# EAGLE design tec_controller (EAGLE 6.5.0)
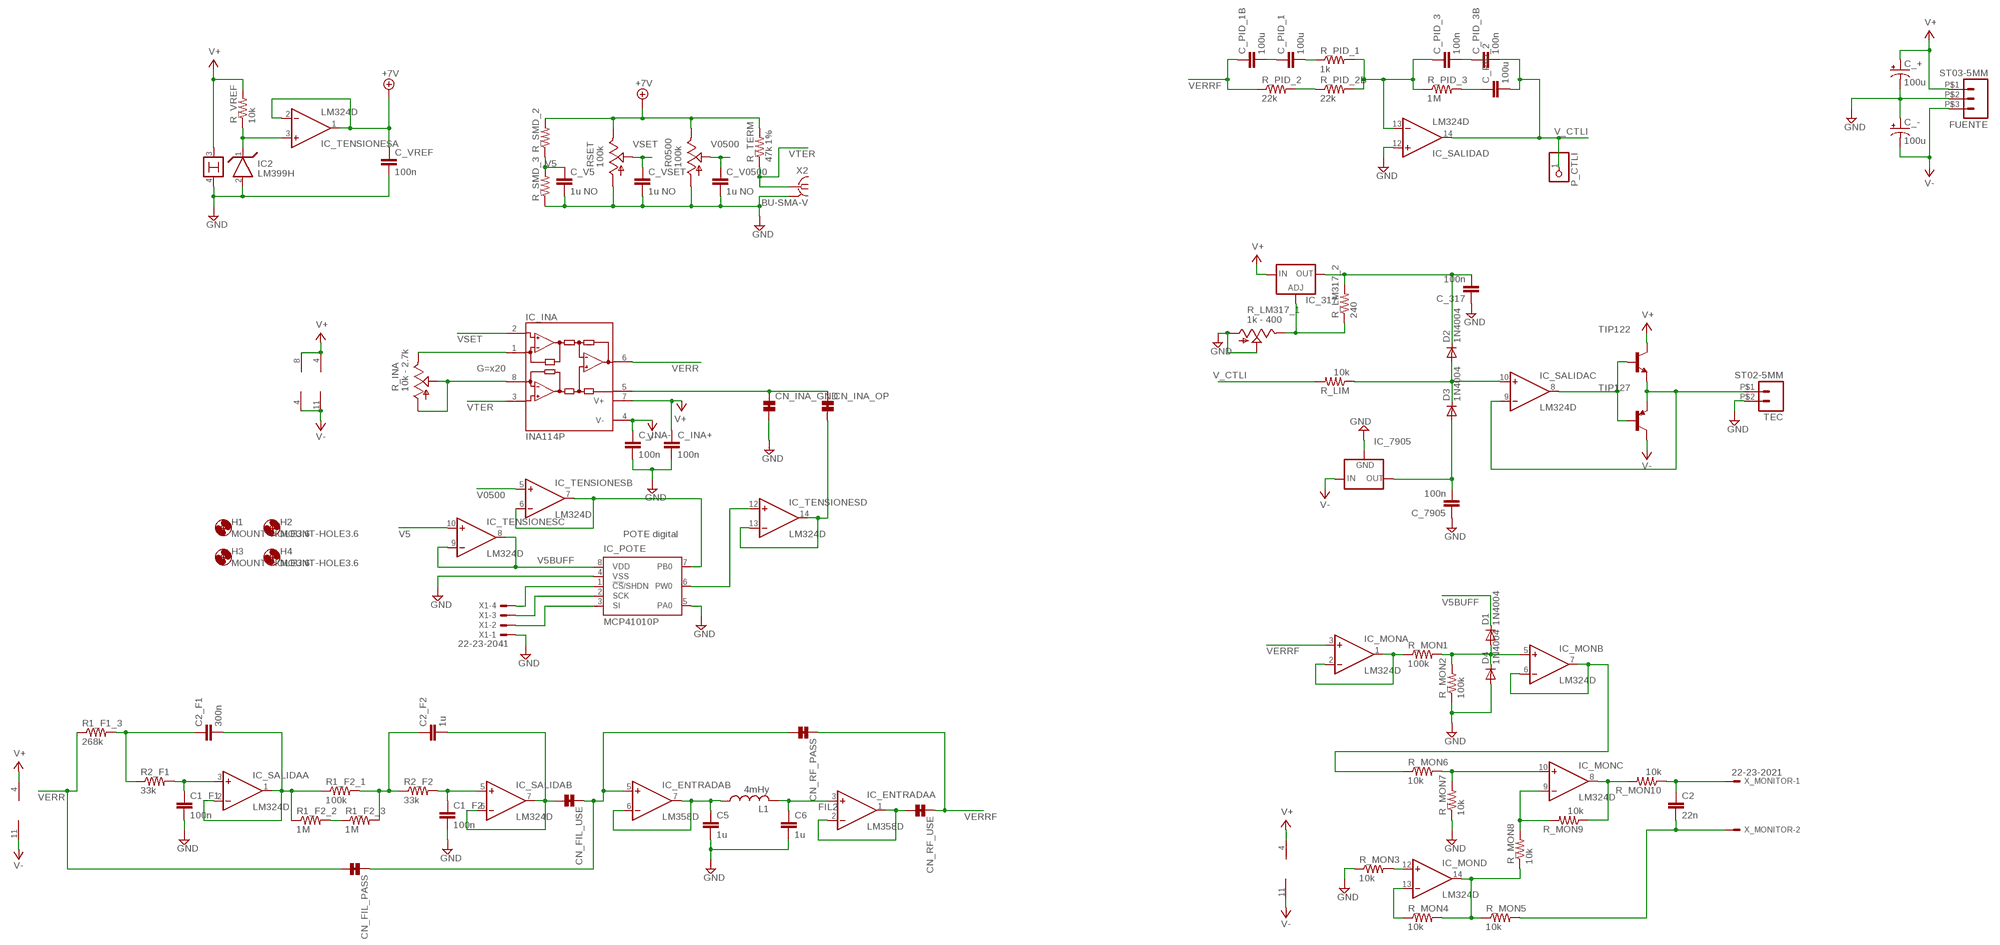
[diagram p0: schematic, sheet 1]

## Parts
C1_F1  100n  C-EUC0603  [C0603]
C1_F2  100n  C-EUC0603  [C0603]
C2  22n  C-EUC1206  [C1206]
C2_F1  300n  C-EUC0603  [C0603]
C2_F2  1u  C-EUC0805  [C0805]
C5  1u  C-EUC0805  [C0805]
C6  1u  C-EUC0805  [C0805]
C_317  100n  C-EUC0603  [C0603]
C_7905  100n  C-EUC0603  [C0603]
C_+  100u  CPOL-USE3.5-10  [E3,5-10]
C_-  100u  CPOL-USE3.5-10  [E3,5-10]
C_INA+  100n  C-EUC0603  [C0603]
C_INA-  100n  C-EUC0603  [C0603]
C_PID_1  100u  C-EU050-050X075  [C050-050X075]
C_PID_1B  100u  C-EU050-050X075  [C050-050X075]
C_PID_2  100u  C-EU050-050X075  [C050-050X075]
C_PID_3  100n  C-EUC0603  [C0603]
C_PID_3B  100n  C-EUC0603  [C0603]
C_V5  1u NO  C-EUC0805  [C0805]
C_V0500  1u NO  C-EUC0805  [C0805]
C_VREF  100n  C-EUC0603  [C0603]
C_VSET  1u NO  C-EUC0805  [C0805]
CN_FIL_PASS  LINK  [LINK_PAC_0603]
CN_FIL_USE  LINK  [LINK_PAC_0603]
CN_INA_GND  LINK  [LINK_PAC_0603]
CN_INA_OP  LINK  [LINK_PAC_0603]
CN_RF_PASS  LINK  [LINK_PAC_0603]
CN_RF_USE  LINK  [LINK_PAC_0603]
D1  1N4004  [DO41-10]
D2  1N4004  [DO41-10]
D3  1N4004  [DO41-10]
D4  1N4004  [DO41-10]
FUENTE  ST03-5MM  [EK500V-03P]
H1  MOUNT-HOLE3.6  [3,6]
H2  MOUNT-HOLE3.6  [3,6]
H3  MOUNT-HOLE3.6  [3,6]
H4  MOUNT-HOLE3.6  [3,6]
IC2  LM399H  [TO39/4]
IC_317  LM317TS  [317TS]
IC_7905  79XXS  [79XXS]
IC_ENTRADA  LM358D  [SO08]
IC_INA  INA114P  [DIL08]
IC_MON  LM324D  [SO14]
IC_POTE  MCP41010P  [DIL8]
IC_SALIDA  LM324D  [SO14]
IC_TENSIONES  LM324D  [SO14]
L1  4mHy  L-US0207/15  [0207/15]
P_CTLI  PINHD-1X1  [1X01]
R1_F1_3  268k  R-US_0207/15  [0207/15]
R1_F2_1  100k  R-US_M1206  [M1206]
R1_F2_2  1M  R-US_M1206  [M1206]
R1_F2_3  1M  R-US_M1206  [M1206]
R2_F1  33k  R-US_M1206  [M1206]
R2_F2  33k  R-US_M1206  [M1206]
R0500  100k  TRIM_US-B64Y  [B64Y]
R_INA  10k - 2.7k  TRIM_US-B64Y  [B64Y]
R_LIM  10k  R-US_M1206  [M1206]
R_LM317_1  1k - 400  TRIM_US-B64Y  [B64Y]
R_LM317_2  240  R-US_0207/10  [0207/10]
R_MON1  100k  R-US_M1206  [M1206]
R_MON2  100k  R-US_M1206  [M1206]
R_MON3  10k  R-US_M1206  [M1206]
R_MON4  10k  R-US_M1206  [M1206]
R_MON5  10k  R-US_M1206  [M1206]
R_MON6  10k  R-US_M1206  [M1206]
R_MON7  10k  R-US_M1206  [M1206]
R_MON8  10k  R-US_M1206  [M1206]
R_MON9  10k  R-US_M1206  [M1206]
R_MON10  10k  R-US_M1206  [M1206]
R_PID_1  1k  R-US_M1206  [M1206]
R_PID_2  22k  R-US_M1206  [M1206]
R_PID_2B  22k  R-US_M1206  [M1206]
R_PID_3  1M  R-US_M1206  [M1206]
R_SMD_2  R-US_M1206  [M1206]
R_SMD_3  R-US_M1206  [M1206]
R_TERM  47k 1%  R-US_0207/10  [0207/10]
R_VREF  10k  R-US_M1206  [M1206]
RSET  100k  TRIM_US-B64Y  [B64Y]
TEC  ST02-5MM  [EK500V-02P]
TIP122  -NPN-TO126V  [TO126V]
TIP127  -PNP-TO126V  [TO126V]
X1  22-23-2041  [22-23-2041]
X2  BU-SMA-V  [BU-SMA-V]
X_MONITOR  22-23-2021  [22-23-2021]

## Nets
+7V: C_VREF.1 IC_TENSIONES.1(A:OUT) IC_TENSIONES.2(A:-IN) R0500.E R_SMD_2.2 R_TERM.2 RSET.E
FIL2: C6.1 IC_ENTRADA.3(A:+IN) L1.2
GND: C1_F1.2 C1_F2.2 C5.2 C6.2 C_317.1 C_7905.1 C_+.- C_-.+ C_INA+.2 C_INA-.2 C_V5.2 C_V0500.2 C_VREF.2 C_VSET.2 CN_INA_GND.2 D4.A FUENTE.P$2 IC2.2 IC2.4 IC_7905.GND IC_POTE.4(VSS) IC_POTE.5(PA0) IC_SALIDA.12(D:+IN) R0500.A R_LM317_1.A R_LM317_1.S R_MON2.1 R_MON3.1 R_MON7.1 R_SMD_3.1 RSET.A TEC.P$2 X1.1 X2.2 X2.3 X2.4 X2.5
N$1: IC2.1 IC_TENSIONES.3(A:+IN) R_VREF.1
N$2: IC_INA.1(RG) R_INA.E
N$3: IC_INA.8(RG) R_INA.A R_INA.S
N$4: C_PID_1.2 R_PID_1.1
N$5: IC_MON.1(A:OUT) IC_MON.2(A:-IN) R_MON1.1
N$6: IC_MON.12(D:+IN) R_MON3.2
N$7: C5.1 IC_ENTRADA.6(B:-IN) IC_ENTRADA.7(B:OUT) L1.1
N$8: CN_RF_USE.2 IC_ENTRADA.1(A:OUT) IC_ENTRADA.2(A:-IN)
N$9: C2_F1.1 R1_F1_3.2 R2_F1.1
N$10: C1_F1.1 IC_SALIDA.3(A:+IN) R2_F1.2
N$11: C2_F1.2 IC_SALIDA.1(A:OUT) IC_SALIDA.2(A:-IN) R1_F2_1.1 R1_F2_2.1
N$12: R1_F2_2.2 R1_F2_3.1
N$13: C2_F2.1 R1_F2_1.2 R1_F2_3.2 R2_F2.1
N$14: IC_POTE.7(PB0) IC_TENSIONES.6(B:-IN) IC_TENSIONES.7(B:OUT)
N$15: C1_F2.1 IC_SALIDA.5(B:+IN) R2_F2.2
N$16: IC_POTE.6(PW0) IC_TENSIONES.12(D:+IN)
N$17: CN_INA_GND.1 CN_INA_OP.1 IC_INA.5(REF)
N$18: IC_POTE.1(!CS!/SHDN) X1.4
N$19: CN_INA_OP.2 IC_TENSIONES.13(D:-IN) IC_TENSIONES.14(D:OUT)
N$20: IC_POTE.2(SCK) X1.3
N$21: IC_POTE.3(SI) X1.2
N$22: R_PID_2.2 R_PID_2B.1
N$23: C_PID_1.1 C_PID_1B.2
N$24: C_PID_3.1 IC_SALIDA.13(D:-IN) R_PID_1.2 R_PID_2B.2 R_PID_3.1
N$25: IC_317.1(ADJ) R_LM317_1.E R_LM317_2.1
N$26: C_PID_2.1 R_PID_3.2
N$27: D2.A D3.C IC_SALIDA.10(C:+IN) R_LIM.1
N$28: C_PID_3.2 C_PID_3B.1
N$29: IC_SALIDA.8(C:OUT) TIP122.3(B) TIP127.3(B)
N$30: D1.A D4.C IC_MON.5(B:+IN) R_MON1.2 R_MON2.2
N$31: IC_MON.6(B:-IN) IC_MON.7(B:OUT) R_MON6.1
N$34: IC_MON.10(C:+IN) R_MON6.2 R_MON7.2
N$35: IC_MON.9(C:-IN) R_MON8.2 R_MON9.2
N$36: IC_MON.14(D:OUT) R_MON4.2 R_MON5.1 R_MON8.1
N$37: IC_MON.13(D:-IN) R_MON4.1
N$38: C2.2 R_MON5.2 X_MONITOR.2
N$39: IC_MON.8(C:OUT) R_MON9.1 R_MON10.2
N$40: C2.1 R_MON10.1 X_MONITOR.1
V5: C_V5.1 IC_TENSIONES.10(C:+IN) R_SMD_2.1 R_SMD_3.2
V5BUFF: D1.C IC_POTE.8(VDD) IC_TENSIONES.8(C:OUT) IC_TENSIONES.9(C:-IN)
V0500: C_V0500.1 IC_TENSIONES.5(B:+IN) R0500.S
V+: C_+.+ C_INA+.1 FUENTE.P$1 IC2.3 IC_317.3(IN) IC_ENTRADA.8(P:V+) IC_INA.7(V+) IC_MON.4(P:V+) IC_SALIDA.4(P:V+) IC_TENSIONES.4(P:V+) R_VREF.2 TIP122.2(C)
V-: C_-.- C_INA-.1 FUENTE.P$3 IC_7905.IN IC_ENTRADA.4(P:V-) IC_INA.4(V-) IC_MON.11(P:V-) IC_SALIDA.11(P:V-) IC_TENSIONES.11(P:V-) TIP127.2(C)
V_317: C_317.2 D2.C IC_317.2(OUT) R_LM317_2.2
V_7905: C_7905.2 D3.A IC_7905.OUT
V_CTLI: C_PID_2.2 C_PID_3B.2 IC_SALIDA.14(D:OUT) P_CTLI.1 R_LIM.2
VERR: CN_FIL_PASS.2 IC_INA.6(OUT) R1_F1_3.1
VERRF: C_PID_1B.1 CN_RF_PASS.1 CN_RF_USE.1 IC_MON.3(A:+IN) R_PID_2.1
VERRF_B: CN_FIL_PASS.1 CN_FIL_USE.1 CN_RF_PASS.2 IC_ENTRADA.5(B:+IN)
VERRF_SALIDA: C2_F2.2 CN_FIL_USE.2 IC_SALIDA.6(B:-IN) IC_SALIDA.7(B:OUT)
VSET: C_VSET.1 IC_INA.2(-IN) RSET.S
VTEC: IC_SALIDA.9(C:-IN) TEC.P$1 TIP122.1(E) TIP127.1(E)
VTER: IC_INA.3(+IN) R_TERM.1 X2.1

## Notes on the sheet
- G=x20
- POTE digital

## Library data of the parts
C1_F1 C1_F2 C2 C2_F1 C2_F2 C5 C6 C_317 C_7905 C_INA+ C_INA- C_PID_1 C_PID_1B C_PID_2 C_PID_3 C_PID_3B C_V5 C_V0500 C_VREF C_VSET = rcl:C-EU: CAPACITOR, European symbol
C_+ C_- = rcl:CPOL-US: POLARIZED CAPACITOR, American symbol
CN_FIL_PASS CN_FIL_USE CN_INA_GND CN_INA_OP CN_RF_PASS CN_RF_USE = 00_Lolo:LINK
D1-D4 = diode:1N4004: DIODE general purpose rectifier, 1 A
FUENTE = con-dinkle:ST03: Dinkle® Screw Terminal Block - 3 Way -5MM: EK500V series. Rated at 20A, 300VAC. Cable size: 2mm² Supplier: Altronics P2035A Source: http://www.dinkle.com/upfiles/proter21253708953.pdf -3.5MM: ED350V series. Rated at 10A, 300VAC. Cable size: 1.4mm² Supplier: Altronics P2029 Source: http://www.dinkle.com/upfiles/proter21253714491.pdf
H1-H4 = holes:MOUNT-HOLE: MOUNTING HOLE with drill center marker
IC2 = linear:LM399H: Precision Z DIODE
IC_317 = v-reg:LM317TS: VOLTAGE REGULATOR
IC_7905 = v-reg:79XXS: VOLTAGE REGULATOR
IC_ENTRADA = linear:LM358: OP AMP also LM158; LM258; LM2904 Source: http://cache.national.com/ds/LM/LM158.pdf
IC_INA = burr-brown:INA114: Precision Instrumentation Amplifier; MF: TEXAS INSTRUMENTS; MPN: INA114BP; OC_FARNELL: 1212399; OC_NEWARK: 74K3810
IC_MON IC_SALIDA IC_TENSIONES = linear:LM324: OP AMP
IC_POTE = 00_Lolo:MCP41010: Single/Dual Digital Potentiometer with SPI TM Interface Source: http://che126.che.caltech.edu/11195c.pdf; MF: MICROCHIP
L1 = rcl:L-US: INDUCTOR, American symbol
P_CTLI = pinhead:PINHD-1X1: PIN HEADER
R1_F1_3 R1_F2_1-R1_F2_3 R2_F1 R2_F2 R_LIM R_LM317_2 R_MON1-R_MON10 R_PID_1 R_PID_2 R_PID_2B R_PID_3 R_SMD_2 R_SMD_3 R_TERM R_VREF = rcl:R-US_: RESISTOR, American symbol
R0500 R_INA R_LM317_1 RSET = pot:TRIM_US-: POTENTIOMETER
TEC = con-dinkle:ST02: Dinkle® Screw Terminal Block - 2 Way -5MM: EK500V series. Rated at 20A, 300VAC. Cable size: 2mm² Supplier: Altronics P2034A Source: http://www.dinkle.com/upfiles/proter21253708953.pdf -5.08MM: The back half of a EK500V4R-04P. Rated at 20A, 300VAC. Cable size: 2mm² Supplier: Altronics P2024 (half of) Source: http://www.dinkle.com/upfiles/proter21253708833.pdf -3.5MM: ED350V series. Rated at 10A, 300VAC. Cable size: 1.4mm² Supplier: Altronics P2028 Source: http://www.dinkle.com/upfiles/proter21253714491.pdf
TIP122 = transistor:*-NPN-: NPN Transistror BF959 corrected 2008.03.06
TIP127 = transistor:*-PNP-: PNP Transistror
X1 = con-molex:22-23-2041: .100" (2.54mm) Center Header - 4 Pin; MF: MOLEX; MPN: 22-23-2041; OC_FARNELL: 1462920; OC_NEWARK: 38C0355
X2 = con-coax:BU-SMA-V: FEMALE SMA CONNECTOR Radiall distributor RS 112-3794; OC_FARNELL: unknown; OC_NEWARK: unknown
X_MONITOR = con-molex:22-23-2021: .100" (2.54mm) Center Header - 2 Pin; MF: MOLEX; MPN: 22-23-2021; OC_FARNELL: 1462926; OC_NEWARK: 25C3832

## Board
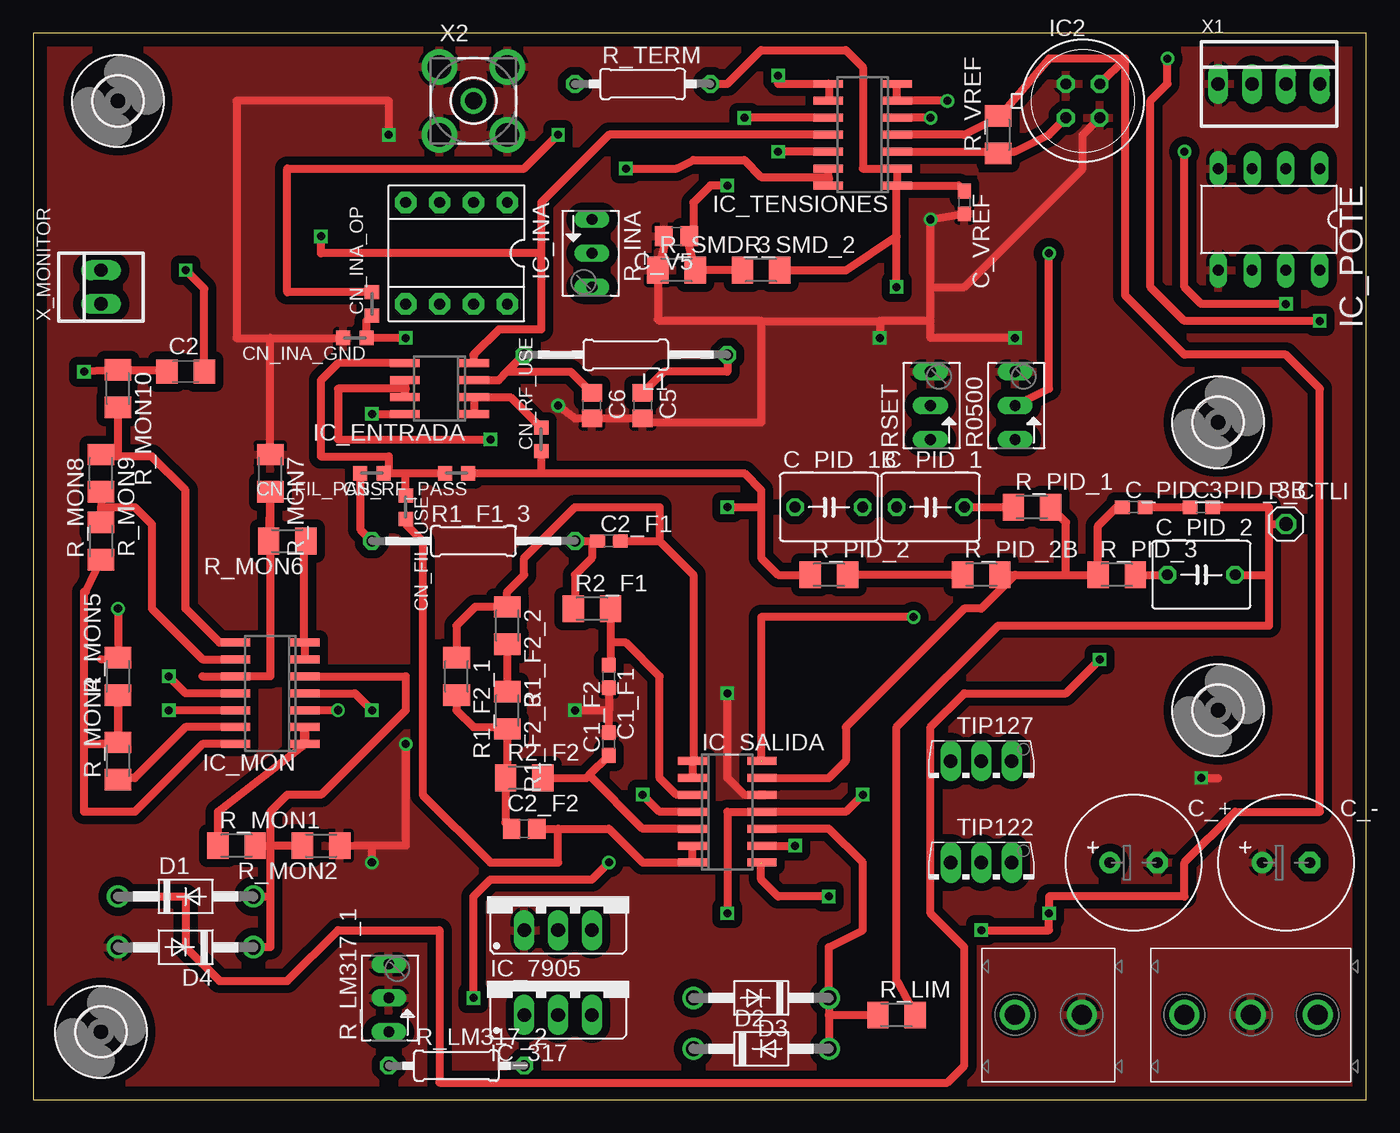
[diagram p1: board, top side]
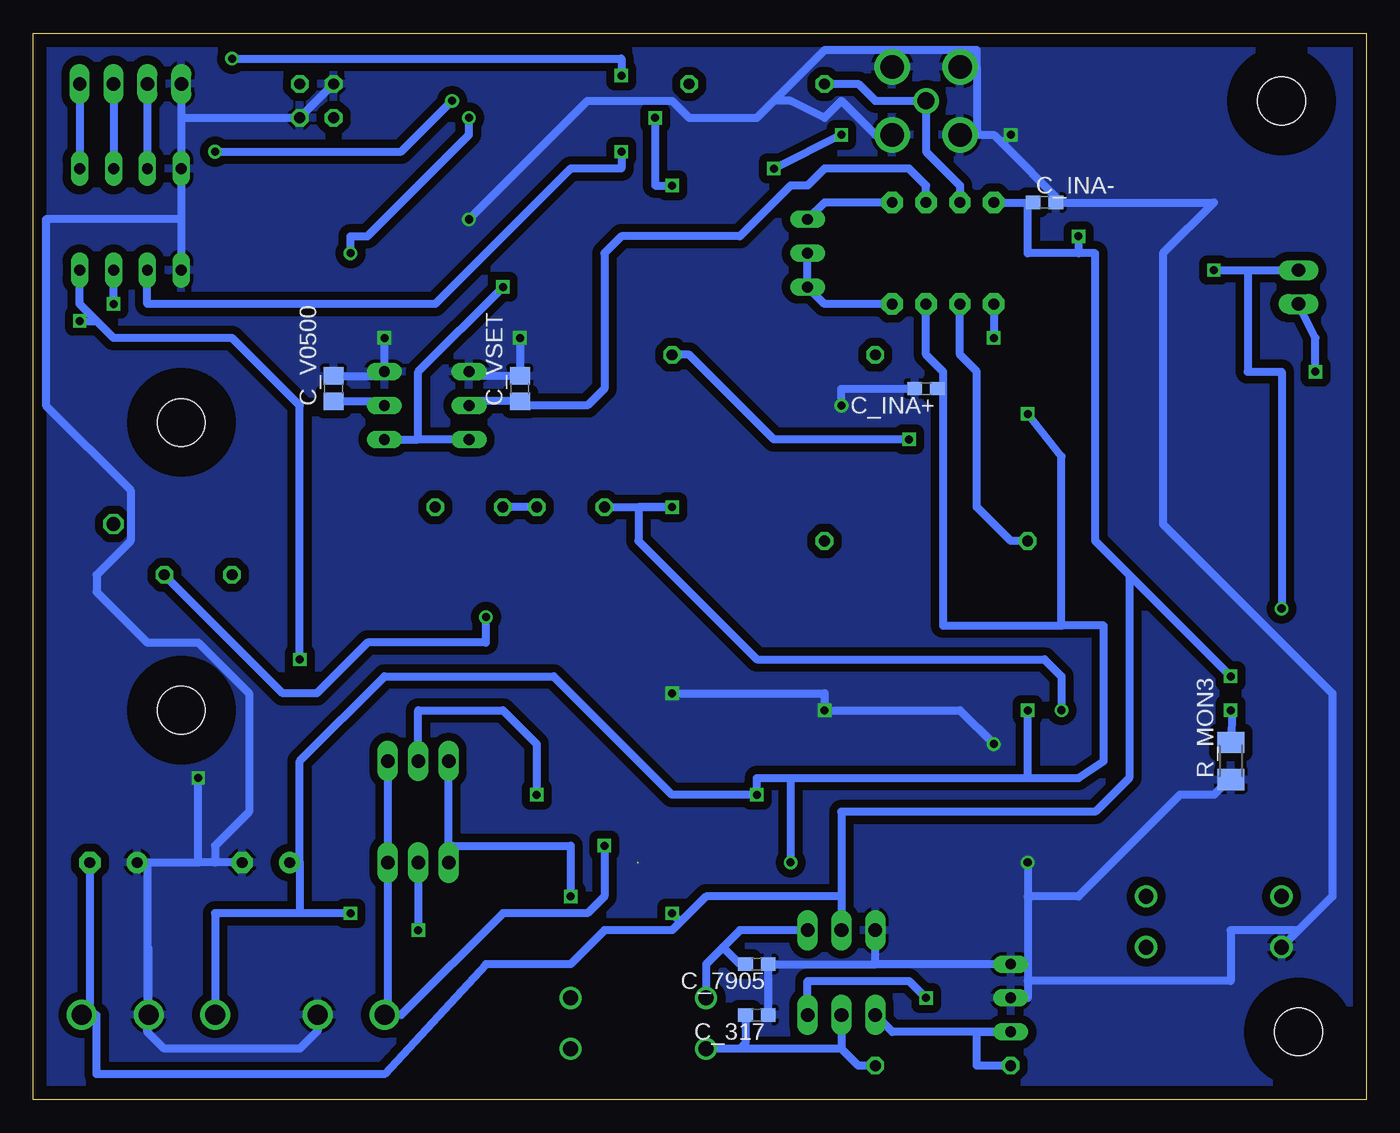
[diagram p2: board, bottom side, seen from below]

Size 100 x 80 mm. Coordinates in mm from the lower left corner, seen from the top.
Outline: 0,0 100,0 100,80 0,80 0,0
Copper layers (1*16): Top 0.035mm / dielectric 1.5mm / Bottom 0.035mm
Design rules "default *": minimum track width 24mil, minimum drill 24mil, track to track 24mil, track to pad 16mil, pad to pad 16mil, via to via 16mil, smd to smd 8mil, copper to edge 40mil, drill to drill 8mil, minimum pad ring 10mil, minimum via ring 8mil, stop-mask expansion 4mil, vias tented up to drill 0mil, thermal gap 10mil

### Footprints (pad centres in the part's own frame; a part is rotated, then mirrored left to right if it is on the bottom)
C0603 = smd 1.1 x 1: 1 -0.85,0; 2 0.85,0
C1206 = smd 1.6 x 1.8: 1 -1.4,0; 2 1.4,0
C0805 = smd 1.3 x 1.5: 1 -0.95,0; 2 0.95,0
E3,5-10 = drill 0.813 pad 1.6: + -1.778,0 | drill 0.813 pad 1.6 octagon: - 1.778,0
C050-050X075 = drill 0.813 octagon: 1 -2.54,0; 2 2.54,0
LINK_PAC_0603 = smd 1.05 x 1.08: 1 -0.875,0; 2 0.875,0
DO41-10 = drill 1.118: A 5.08,0; C -5.08,0
EK500V-03P = drill 1.5: P$1 0,0; P$2 5,0; P$3 10,0
3,6 = hole 3.6: 0,0
TO39/4 = drill 0.813 octagon: 1 -1.27,-1.27; 2 1.27,-1.27; 3 1.27,1.27; 4 -1.27,1.27
317TS = drill 1.016 long: 1 -2.54,-2.54; 2 0,-2.54; 3 2.54,-2.54
79XXS = drill 1.016 long: GND -2.54,-2.54; IN 0,-2.54; OUT 2.54,-2.54
SO08 = smd 0.6 x 2.2: 1 -1.905,-2.6; 2 -0.635,-2.6; 3 0.635,-2.6; 4 1.905,-2.6; 5 1.905,2.6; 6 0.635,2.6; 7 -0.635,2.6; 8 -1.905,2.6
DIL08 = drill 0.813 pad 1.6 octagon: 1 -3.81,-3.81; 2 -1.27,-3.81; 3 1.27,-3.81; 4 3.81,-3.81; 5 3.81,3.81; 6 1.27,3.81; 7 -1.27,3.81; 8 -3.81,3.81
SO14 = smd 0.6 x 2.2: 1 -3.81,-2.6; 2 -2.54,-2.6; 3 -1.27,-2.6; 4 0,-2.6; 5 1.27,-2.6; 6 2.54,-2.6; 7 3.81,-2.6; 8 3.81,2.6; 9 2.54,2.6; 10 1.27,2.6; 11 0,2.6; 12 -1.27,2.6; 13 -2.54,2.6; 14 -3.81,2.6
DIL8 = drill 0.813 long: 1 -3.81,-3.81; 2 -1.27,-3.81; 3 1.27,-3.81; 4 3.81,-3.81; 5 3.81,3.81; 6 1.27,3.81; 7 -1.27,3.81; 8 -3.81,3.81
0207/15 = drill 0.813 octagon: 1 -7.62,0; 2 7.62,0
1X01 = drill 1.016 octagon: 1 0,0
M1206 = smd 1.6 x 2: 1 -1.4,0; 2 1.4,0
B64Y = drill 0.813 long: A 2.54,0; E -2.54,0; S 0,0
0207/10 = drill 0.813 octagon: 1 -5.08,0; 2 5.08,0
EK500V-02P = drill 1.5: P$1 0,0; P$2 5,0
TO126V = drill 1.016 long: 1 -2.286,-1.27; 2 0,-1.27; 3 2.286,-1.27
22-23-2041 = drill 1 long: 1 -3.81,0; 2 -1.27,0; 3 1.27,0; 4 3.81,0
BU-SMA-V = drill 1.27: 1 0,0 | drill 1.778: 2 -2.55,2.55; 3 2.55,2.55; 4 2.55,-2.55; 5 -2.55,-2.55
22-23-2021 = drill 1 long: 1 -1.27,0; 2 1.27,0

### Placement (x,y rotation side)
C1_F1  43.18,31.75 270 top
C1_F2  43.18,26.67 90 top
C2  11.43,54.61 0 top
C2_F1  43.18,41.91 0 top
C2_F2  36.83,20.32 0 top
C5  45.72,52.07 270 top
C6  41.91,52.07 270 top
C_317  45.72,6.35 180 bottom
C_7905  45.72,10.16 180 bottom
C_+  82.55,17.78 0 top
C_-  93.98,17.78 0 top
C_INA+  33.02,53.34 180 bottom
C_INA-  24.13,67.31 0 bottom
C_PID_1  67.31,44.45 0 top
C_PID_1B  59.69,44.45 0 top
C_PID_2  87.63,39.37 0 top
C_PID_3  82.55,44.45 0 top
C_PID_3B  87.63,44.45 0 top
C_V5  48.26,64.77 180 top
C_V0500  77.47,53.34 90 bottom
C_VREF  69.85,67.31 270 top
C_VSET  63.5,53.34 90 bottom
CN_FIL_PASS  25.4,46.99 180 top
CN_FIL_USE  27.94,44.45 270 top
CN_INA_GND  24.13,57.15 180 top
CN_INA_OP  25.4,59.69 90 top
CN_RF_PASS  31.75,46.99 180 top
CN_RF_USE  38.1,49.53 90 top
D1  11.43,15.24 0 top
D2  54.61,3.81 0 top
D3  54.61,7.62 180 top
D4  11.43,11.43 180 top
FUENTE  86.36,6.35 0 top
H1  6.35,74.93 0 top
H2  5.08,5.08 0 top
H3  88.9,29.21 0 top
H4  88.9,50.8 0 top
IC2  78.74,74.93 0 top
IC_317  39.37,8.89 0 top
IC_7905  39.37,15.24 0 top
IC_ENTRADA  30.48,53.34 90 top
IC_INA  31.75,63.5 180 top
IC_MON  17.78,30.48 90 top
IC_POTE  92.71,66.04 180 top
IC_SALIDA  52.07,21.59 270 top
IC_TENSIONES  62.23,72.39 90 top
L1  44.45,55.88 180 top
P_CTLI  93.98,43.18 0 top
R1_F1_3  33.02,41.91 0 top
R1_F2_1  31.75,31.75 270 top
R1_F2_2  35.56,35.56 270 top
R1_F2_3  35.56,29.21 270 top
R2_F1  41.91,36.83 0 top
R2_F2  36.83,24.13 0 top
R0500  73.66,52.07 90 top
R_INA  41.91,63.5 270 top
R_LIM  64.77,6.35 0 top
R_LM317_1  26.67,7.62 90 top
R_LM317_2  31.75,2.54 0 top
R_MON1  15.24,19.05 0 top
R_MON2  21.59,19.05 180 top
R_MON3  10.16,25.4 90 bottom
R_MON4  6.35,25.4 90 top
R_MON5  6.35,31.75 90 top
R_MON6  19.05,41.91 180 top
R_MON7  17.78,46.99 270 top
R_MON8  5.08,41.91 90 top
R_MON9  5.08,46.99 270 top
R_MON10  6.35,53.34 270 top
R_PID_1  74.93,44.45 0 top
R_PID_2  59.69,39.37 0 top
R_PID_2B  71.12,39.37 0 top
R_PID_3  81.28,39.37 0 top
R_SMD_2  54.61,62.23 0 top
R_SMD_3  48.26,62.23 0 top
R_TERM  45.72,76.2 0 top
R_VREF  72.39,72.39 90 top
RSET  67.31,52.07 90 top
TEC  73.66,6.35 0 top
TIP122  71.12,16.51 180 top
TIP127  71.12,24.13 180 top
X1  92.71,76.2 0 top
X2  33.02,74.93 0 top
X_MONITOR  5.08,60.96 90 top

### Tracks (layer width: path | path; a pad name or v marks a point on that pad's centre or on a via)
+7V  (via drill 0.6)
  Top 0.61: IC_TENSIONES.1 IC_TENSIONES.2 62.23,69.85 62.23,77.47 60.96,78.74 54.61,78.74 52.07,76.2 R_TERM.2 | IC_TENSIONES.1 69.43,68.58 C_VREF.1 | R_SMD_2.2 60.96,62.23 64.77,64.77 | 64.77,64.77 64.77,68.52 IC_TENSIONES.1 | v64.77,60.96 64.77,64.77
  Bottom 0.61: RSET.E 71.12,49.53 | R0500.E 71.12,49.53 | 71.12,49.53 71.12,54.61 v64.77,60.96
FIL2
  Top 0.61: L1.2 35.56,54.61 | IC_ENTRADA.3 34.92,53.98 35.56,54.61 | 35.56,54.61 40.32,54.61 C6.1
GND  (via drill 0.6, 0.61)
  Top 0.61: C_V5.2 47.31,63.95 R_SMD_3.1 46.86,58.55 46.99,58.42 54.61,58.42 | C1_F1.2 43.18,29.21 | C1_F2.2 43.18,29.21 | 43.18,29.21 v40.64,29.21 | 17.78,57.15 R_MON7.1 17.78,48.26 | 17.78,57.15 15.24,57.15 15.24,74.93 26.67,74.93 v26.67,72.39 | 17.78,57.15 CN_INA_GND.2 | v39.37,52.07 40.64,51.12 C6.2 C5.2 45.72,50.8 54.61,50.8 54.61,58.42 | 67.31,58.42 67.31,60.96 | 67.31,60.96 v67.31,66.04 C_VREF.2 | 25.4,19.05 27.94,19.05 v27.94,26.67 | 67.31,60.96 69.85,60.96 78.74,69.85 78.74,72.39 IC2.2 | v25.4,17.78 25.4,19.05 | 25.4,19.05 24.13,19.05 22.86,18.92 R_MON2.1 | v52.07,30.48 52.07,24.13 53.34,22.86 IC_SALIDA.12 | 54.61,58.42 63.5,58.42 | v73.66,57.15 67.31,57.15 67.31,58.42 | 67.31,58.42 63.5,58.42 | 63.5,58.42 v63.5,57.15 | v87.63,24.13 88.9,24.13
  Bottom 0.61: RSET.A 66.99,54.29 C_VSET.2 v63.5,57.15 | C_V0500.2 73.98,54.29 R0500.A v73.66,57.15 | C_317.1 C_7905.1 36.83,10.16 | 36.83,10.16 IC_7905.GND | 36.83,10.16 R_LM317_1.A 25.4,10.16 | X1.1 88.9,73.66 | 88.9,73.66 IC_POTE.4 88.9,66.04 | 88.9,66.04 IC_POTE.5 | R_MON3.1 10.16,24.13 11.43,22.86 13.97,22.86 21.59,15.24 25.4,15.24 | 27.3,71.75 27.94,72.39 29.21,72.39 | 27.3,71.75 22.86,67.31 | 29.21,72.39 X2.5 | 5.08,12.7 2.54,15.24 2.54,30.48 15.24,43.18 15.24,63.5 11.43,67.31 22.86,67.31 | 22.86,67.31 C_INA-.2 | v39.37,52.07 39.37,53.34 C_INA+.2 | 88.9,66.04 99.06,66.04 99.06,52.07 92.71,45.72 92.71,41.91 95.25,39.37 95.25,38.1 91.44,34.29 87.63,34.29 83.82,30.48 83.82,21.59 86.36,19.05 86.36,17.78 | 92.71,17.78 C_-.+ | v25.4,17.78 25.4,15.24 | 25.4,15.24 25.4,10.16 | 25.4,10.16 25.4,8.89 | 25.4,8.89 25.4,7.62 R_LM317_1.S | v27.94,26.67 30.48,29.21 v40.64,29.21 40.64,30.48 v52.07,30.48 | 88.9,73.66 IC2.2 IC2.4 | v67.31,66.04 58.42,74.93 52.07,74.93 50.8,73.66 45.72,73.66 44.45,74.93 | C_-.+ 91.44,17.78 91.44,11.43 | 91.44,11.43 91.44,6.43 FUENTE.P$2 | FUENTE.P$2 91.36,11.35 91.44,11.43 | D4.A 5.08,12.7 | 5.08,12.7 10.16,12.7 10.16,8.89 25.4,8.89 | TEC.P$2 78.66,5.16 80.01,3.81 90.17,3.81 91.44,5.08 91.44,6.27 FUENTE.P$2 | v26.67,72.39 27.3,71.75 | 29.21,77.47 29.21,72.39 | X2.2 29.22,77.48 29.21,77.47 | 29.21,77.47 29.21,78.74 35.56,78.74 | 35.56,78.74 X2.3 35.57,78.73 35.56,78.74 | 35.56,78.74 40.64,78.74 44.45,74.93 | X2.4 36.82,72.38 39.37,74.93 40.64,73.66 43.18,74.93 44.45,74.93 | C_+.- 86.36,17.78 | 86.36,17.78 87.63,17.78 | 87.63,17.78 v87.63,24.13 | C_-.+ 87.63,17.78
  pour Bottom: 0,80.01 0,0 100.33,0 100.33,80.01
  pour Top: 0,80.01 0,0 100.33,0 100.33,80.01
N$1
  Top 0.61: IC_TENSIONES.3 72.39,71.12 | IC2.1 76.2,72.39 73.66,71.12 72.39,71.12 | 72.39,71.12 R_VREF.1
N$2
  Bottom 0.61: IC_INA.1 40.64,67.31 R_INA.E
N$3
  Bottom 0.61: IC_INA.8 40.64,59.69 R_INA.A R_INA.S
N$4
  Top 0.61: C_PID_1.2 R_PID_1.1
N$5
  Top 0.61: 20.32,26.67 IC_MON.1 13.84,21.59 R_MON1.1 | 20.32,26.67 20.32,27.88 IC_MON.2 20.38,26.73 20.32,26.67
N$6  (via drill 0.6)
  Top 0.61: IC_MON.12 v10.16,29.21
  Bottom 0.61: v10.16,29.21 10.03,29.21 R_MON3.2
N$7  (via drill 0.6)
  Top 0.61: IC_ENTRADA.6 IC_ENTRADA.7 27.88,53.28 27.94,53.34 22.86,53.34 22.86,49.53 v34.29,49.53 | L1.1 52.07,54.61 47.31,54.61 C5.1
  Bottom 0.61: v34.29,49.53 44.45,49.53 50.8,55.88 L1.1
N$8
  Top 0.61: IC_ENTRADA.1 IC_ENTRADA.2 35.8,52.7 CN_RF_USE.2
N$9
  Top 0.61: 41.91,41.91 C2_F1.1 | R1_F1_3.2 41.91,41.91 | 41.91,41.91 41.91,40.64 40.64,39.37 40.64,36.96 R2_F1.1
N$10
  Top 0.61: R2_F1.2 43.31,34.29 | 43.31,34.29 43.31,32.73 C1_F1.1 | IC_SALIDA.3 48.26,22.86 46.99,24.13 46.99,31.75 44.45,34.29 43.31,34.29
N$11
  Top 0.61: C2_F1.2 46.99,41.91 | 46.99,41.91 49.53,39.37 49.53,25.46 IC_SALIDA.1 IC_SALIDA.2 | 46.99,41.91 46.99,44.45 40.64,44.45 36.83,40.64 36.83,39.37 35.56,38.1 R1_F2_2.1 33.15,36.96 31.75,35.56 R1_F2_1.1
N$12
  Top 0.61: R1_F2_2.2 R1_F2_3.1
N$13
  Top 0.61: R1_F2_1.2 31.75,29.21 33.02,27.94 35.43,27.94 R1_F2_3.2 35.56,24.26 R2_F2.1 35.43,20.77 C2_F2.1
N$14  (via drill 0.6, 0.61)
  Top 0.61: IC_TENSIONES.7 64.77,76.2 64.77,74.93 IC_TENSIONES.6 v68.58,74.93 | v93.98,59.69 87.63,59.69 86.36,60.96 v86.36,71.12
  Bottom 0.61: v68.58,74.93 72.39,71.12 v86.36,71.12 | v93.98,59.69 IC_POTE.7
N$15
  Top 0.61: R2_F2.2 41.49,24.13 41.7,24.34 | 41.7,24.34 C1_F2.1 | IC_SALIDA.5 45.72,20.32 41.7,24.34
N$16  (via drill 0.6)
  Top 0.61: IC_TENSIONES.12 v55.88,71.12
  Bottom 0.61: v55.88,71.12 55.88,69.85 59.69,69.85 69.85,59.69 91.44,59.69 IC_POTE.6
N$17  (via drill 0.6)
  Top 0.61: CN_INA_OP.1 25,58.42 CN_INA_GND.1 v27.94,57.15
  Bottom 0.61: IC_INA.5 v27.94,57.15
N$18
  Bottom 0.61: X1.4 IC_POTE.1
N$19  (via drill 0.6)
  Top 0.61: CN_INA_OP.2 19.05,60.56 19.05,69.85 36.83,69.85 v39.37,72.39 | IC_TENSIONES.13 IC_TENSIONES.14 59.69,69.22 54.61,69.22 53.34,70.48 49.53,70.48 48.26,69.85 v44.45,69.85
  Bottom 0.61: v39.37,72.39 v44.45,69.85
N$20
  Bottom 0.61: X1.3 IC_POTE.2
N$21
  Bottom 0.61: X1.2 IC_POTE.3
N$22
  Top 0.61: R_PID_2B.1 R_PID_2.2
N$23
  Bottom 0.61: C_PID_1B.2 C_PID_1.1
N$24
  Top 0.61: 73.66,39.37 71.12,36.83 69.85,36.83 60.96,27.94 60.96,25.4 59.69,24.13 IC_SALIDA.13 | 77.47,39.37 77.47,43.31 R_PID_1.2 | 77.47,39.37 R_PID_3.1 79.88,43.05 81.28,44.45 C_PID_3.1 | R_PID_2B.2 73.66,39.37 | 73.66,39.37 77.47,39.37
N$25
  Bottom 0.61: R_LM317_2.1 29.21,2.54 29.21,5.08 R_LM317_1.E 35.56,5.08 IC_317.1
N$26
  Top 0.61: R_PID_3.2 C_PID_2.1
N$27
  Top 0.61: 59.69,6.35 D2.A | 59.69,6.35 R_LIM.1 | 59.69,6.35 D3.C 59.69,11.43 62.23,12.7 62.23,17.78 59.69,20.32 IC_SALIDA.10
N$28
  Top 0.61: C_PID_3.2 C_PID_3B.1
N$29  (via drill 0.6)  (1 unrouted)
  Top 0.61: v59.69,15.24 55.88,15.24 54.61,16.51 54.61,17.72
  Bottom 0.61: TIP127.3 TIP122.3 68.58,19.05 59.69,19.05 v59.69,15.24
N$30
  Top 0.61: R_MON1.2 17.78,19.05 | R_MON2.2 17.78,19.05 | 17.78,19.05 17.78,15.24 | D1.A 17.78,15.24 | IC_MON.5 27.94,31.75 27.94,29.21 21.59,22.86 19.05,22.86 17.78,21.59 17.78,19.05 | 17.78,15.24 17.78,11.43 D4.C
N$31
  Top 0.61: IC_MON.6 IC_MON.7 20.32,34.29 20.32,41.78 R_MON6.1
N$34
  Top 0.61: R_MON6.2 R_MON7.2 17.78,31.75 IC_MON.10 12.7,31.75
N$35
  Top 0.61: R_MON9.2 5.08,44.45 | R_MON8.2 5.08,44.45 | 5.08,44.45 7.62,44.45 8.89,43.18 8.89,36.83 12.7,33.02 IC_MON.9
N$36
  Top 0.61: 5.21,26.67 R_MON4.2 | IC_MON.14 12.7,26.67 7.62,21.59 3.81,21.59 3.81,26.67 | 3.81,26.67 4.95,26.67 | 4.95,26.67 R_MON4.2 | R_MON4.2 R_MON5.1 6.35,26.67 4.95,26.67 | 3.81,26.67 3.81,38.1 3.94,38.1 R_MON8.1
N$37
  Top 0.61: IC_MON.13 11.43,27.94 7.62,24.13 6.48,24.13 R_MON4.1
N$38  (via drill 0.6, 0.61)
  Top 0.61: C2.2 12.83,60.83 v11.43,62.23 | v6.35,36.83 R_MON5.2 5.08,33.02
  Bottom 0.61: v11.43,62.23 8.89,62.23 | 8.89,62.23 X_MONITOR.2 | v6.35,36.83 6.35,54.61 8.89,54.61 8.89,62.23
N$39
  Top 0.61: IC_MON.8 13.97,34.29 11.43,36.83 11.43,45.72 8.89,48.26 6.35,48.26 | 6.35,48.26 5.21,48.26 R_MON9.1 6.22,48.39 6.35,48.26 | 6.35,48.26 R_MON10.2
N$40  (via drill 0.6)
  Top 0.61: C2.1 9.9,54.74 R_MON10.1 v3.81,54.61
  Bottom 0.61: v3.81,54.61 3.81,57.15 X_MONITOR.1
V5  (via drill 0.6)
  Top 0.61: R_SMD_2.1 R_SMD_3.2 49.21,63.95 C_V5.1 49.53,65.09 49.53,67.31 50.8,68.58 v52.07,68.58 | IC_TENSIONES.10 v53.34,73.66
  Bottom 0.61: v53.34,73.66 53.34,68.58 v52.07,68.58
V5BUFF  (via drill 0.6, 0.61)
  Top 0.61: IC_TENSIONES.9 59.69,74.93 59.69,76.2 IC_TENSIONES.8 55.88,76.2 v55.88,76.83 | v85.09,78.11 85.09,76.2 83.82,74.93 83.82,60.96 86.36,58.42 v96.52,58.42 | D1.C 11.43,15.24 11.43,11.43 13.97,8.89 19.05,8.89 22.86,12.7 30.48,12.7 30.48,1.27 68.58,1.27 69.85,2.54 69.85,11.43 67.31,13.97 67.31,27.94 69.85,30.48 77.47,30.48 v80.01,33.02
  Bottom 0.61: v85.09,78.11 55.88,78.11 v55.88,76.83 | v80.01,33.02 80.01,52.07 85.09,57.15 93.98,57.15 95.25,58.42 | 95.25,58.42 96.52,59.69 IC_POTE.8 | v96.52,58.42 95.25,58.42
V0500  (via drill 0.61)
  Top 0.61: v67.31,73.66 IC_TENSIONES.5 64.77,73.66 | v76.2,63.5 76.2,53.34 R0500.S
  Bottom 0.61: C_V0500.1 73.98,52.39 R0500.S | v76.2,63.5 76.2,64.77 74.93,64.77 67.31,72.39 v67.31,73.66
V+  (via drill 0.6, 0.61)
  Top 0.61: IC_MON.4 24.13,30.48 v25.4,29.21 | IC_SALIDA.4 46.99,21.59 v45.72,22.86 | 72.39,73.66 76.2,78.11 81.92,78.11 | 72.39,73.66 69.85,72.39 IC_TENSIONES.4 64.77,72.39 | 72.39,73.66 R_VREF.2 | 81.92,78.11 IC2.3 | 81.92,78.11 81.92,60.33 86.36,55.88 93.98,55.88 96.52,53.34 96.52,21.59 90.17,21.59 86.36,17.78 86.36,15.24 76.2,15.24 v76.2,13.97 76.2,12.7 v71.12,12.7 | v33.02,7.62 33.02,15.24 34.29,16.51 41.91,16.51 v43.18,17.78 | v25.4,51.44 IC_ENTRADA.8
  Bottom 0.61: 43.18,24.13 v43.18,17.78 | 43.18,24.13 45.72,24.13 v45.72,22.86 52.07,22.86 60.96,31.75 73.66,31.75 80.01,25.4 80.01,17.78 | 25.4,24.13 v25.4,29.21 | 43.18,24.13 25.4,24.13 | 22.86,35.56 19.68,35.56 19.68,25.4 21.59,24.13 25.4,24.13 | 31.75,53.34 31.75,54.61 33.02,55.88 IC_INA.7 | 31.75,53.34 C_INA+.1 | FUENTE.P$1 86.36,13.97 80.01,13.97 | 80.01,17.78 80.01,13.97 | 80.01,17.78 C_+.+ | TIP122.2 v71.12,12.7 | IC_317.3 41.91,8.89 34.29,8.89 v33.02,7.62 | 31.75,53.34 31.75,35.56 22.86,35.56 | 22.86,35.56 22.86,48.26 v25.4,51.44 | v76.2,13.97 80.01,13.97
V-  (via drill 0.6)
  Top 0.61: IC_MON.11 11.43,30.48 v10.16,31.75 | IC_ENTRADA.4 33.08,55.82 33.02,55.88 34.92,57.78 38.1,57.78 38.1,63.5 | 59.69,72.39 IC_TENSIONES.11 43.18,72.39 38.1,67.31 38.1,63.5 | v62.23,22.86 60.96,21.59 IC_SALIDA.11 52.07,21.59 v52.07,13.97 | 38.1,63.5 21.59,63.5 v21.59,64.77
  Bottom 0.61: IC_INA.4 25.4,67.31 | 39.37,15.24 39.37,21.59 20.32,21.59 17.78,24.13 17.78,39.37 | 39.37,15.24 IC_7905.IN | 96.52,6.35 FUENTE.P$3 | 51.44,13.34 49.53,15.24 39.37,15.24 | 51.44,13.34 52.07,12.7 57.15,12.7 59.69,10.16 66.04,10.16 73.66,1.91 95.25,1.91 95.25,6.35 FUENTE.P$3 | 21.59,63.5 20.32,63.5 20.32,41.91 17.78,39.37 | 21.59,63.5 25.4,63.5 25.4,67.31 | v10.16,31.75 17.78,39.37 | 25.4,67.31 C_INA-.1 | TIP127.2 71.12,29.21 64.77,29.21 62.23,26.67 v62.23,22.86 | v52.07,13.97 51.44,13.34 | C_-.- 95.76,6.95 FUENTE.P$3 | v21.59,64.77 21.59,63.5
V_317
  Bottom 0.61: C_317.2 46.57,4.23 46.99,3.81 | 46.99,3.81 D2.C | IC_317.2 39.37,3.81 | 39.37,3.81 46.99,3.81 | R_LM317_2.2 38.1,2.54 39.37,3.81
V_7905
  Bottom 0.61: IC_7905.OUT 46.99,12.7 48.26,11.43 | 48.26,11.43 49.53,10.16 D3.A | C_7905.2 46.99,10.16 48.26,11.43
V_CTLI  (via drill 0.61)  (1 unrouted)
  Top 0.61: C_PID_3B.2 92.71,44.45 92.71,43.18 | 92.71,43.18 92.71,39.37 | 92.71,43.18 P_CTLI.1 | C_PID_2.2 92.71,39.37 | 92.71,39.37 92.71,35.56 72.39,35.56 64.77,27.94 64.77,8.89 64.9,8.76 R_LIM.2 66.04,6.35 | v66.04,36.2 54.61,36.2 54.61,25.4
  Bottom 0.61: v66.04,36.2 66.04,34.29 74.93,34.29 78.74,30.48 81.28,30.48 C_PID_2.2
VERR
  Top 0.61: CN_FIL_PASS.2 24.52,42.78 R1_F1_3.1
  Bottom 0.61: R1_F1_3.1 26.67,41.91 29.21,44.45 29.21,54.61 30.48,55.88 IC_INA.6
VERRF  (via drill 0.6, 0.61)
  Top 0.61: 54.61,44.45 54.61,45.72 53.34,46.99 38.1,46.99 | 54.61,44.45 54.61,40.64 55.88,39.37 R_PID_2.1 | v22.86,29.21 IC_MON.3 | CN_RF_PASS.1 38.1,46.99 | CN_RF_USE.1 38.1,46.99 | v52.07,44.45 54.61,44.45
  Bottom 0.61: v22.86,29.21 22.86,31.75 24.13,33.02 45.72,33.02 54.61,41.91 54.61,44.45 v52.07,44.45 C_PID_1B.1
VERRF_B
  Top 0.61: 27.94,46.99 CN_FIL_PASS.1 26.67,47.38 26.67,48.26 21.59,48.26 21.59,53.98 22.86,55.24 IC_ENTRADA.5 | 27.94,46.99 CN_RF_PASS.2 | CN_FIL_USE.1 27.94,46.99
VERRF_SALIDA
  Top 0.61: C2_F2.2 39.37,20.32 | 39.37,20.32 43.18,20.32 45.72,17.78 IC_SALIDA.7 IC_SALIDA.6 | 39.37,20.32 39.37,17.78 34.29,17.78 29.21,22.86 29.21,41.91 27.94,43.18 CN_FIL_USE.2
VSET
  Bottom 0.61: RSET.S 66.99,52.39 C_VSET.1 63.18,52.07 58.42,52.07 57.15,53.34 57.15,63.5 55.88,64.77 46.99,64.77 43.18,68.58 41.91,68.58 40.64,69.85 34.29,69.85 33.02,68.58 IC_INA.2
VTEC  (via drill 0.6)
  Top 0.61: IC_SALIDA.9 v57.15,19.05
  Bottom 0.61: TIP127.1 TIP122.1 73.41,6.6 | 73.41,6.6 73.41,6.35 72.39,6.35 64.77,13.97 58.42,13.97 57.15,15.24 v57.15,19.05 | 73.41,6.6 TEC.P$1
VTER
  Bottom 0.61: R_TERM.1 38.1,76.2 36.83,74.93 X2.1 33.02,71.12 30.48,68.58 IC_INA.3